# Altium schematic sheet AuxBoard.SchDoc
size A
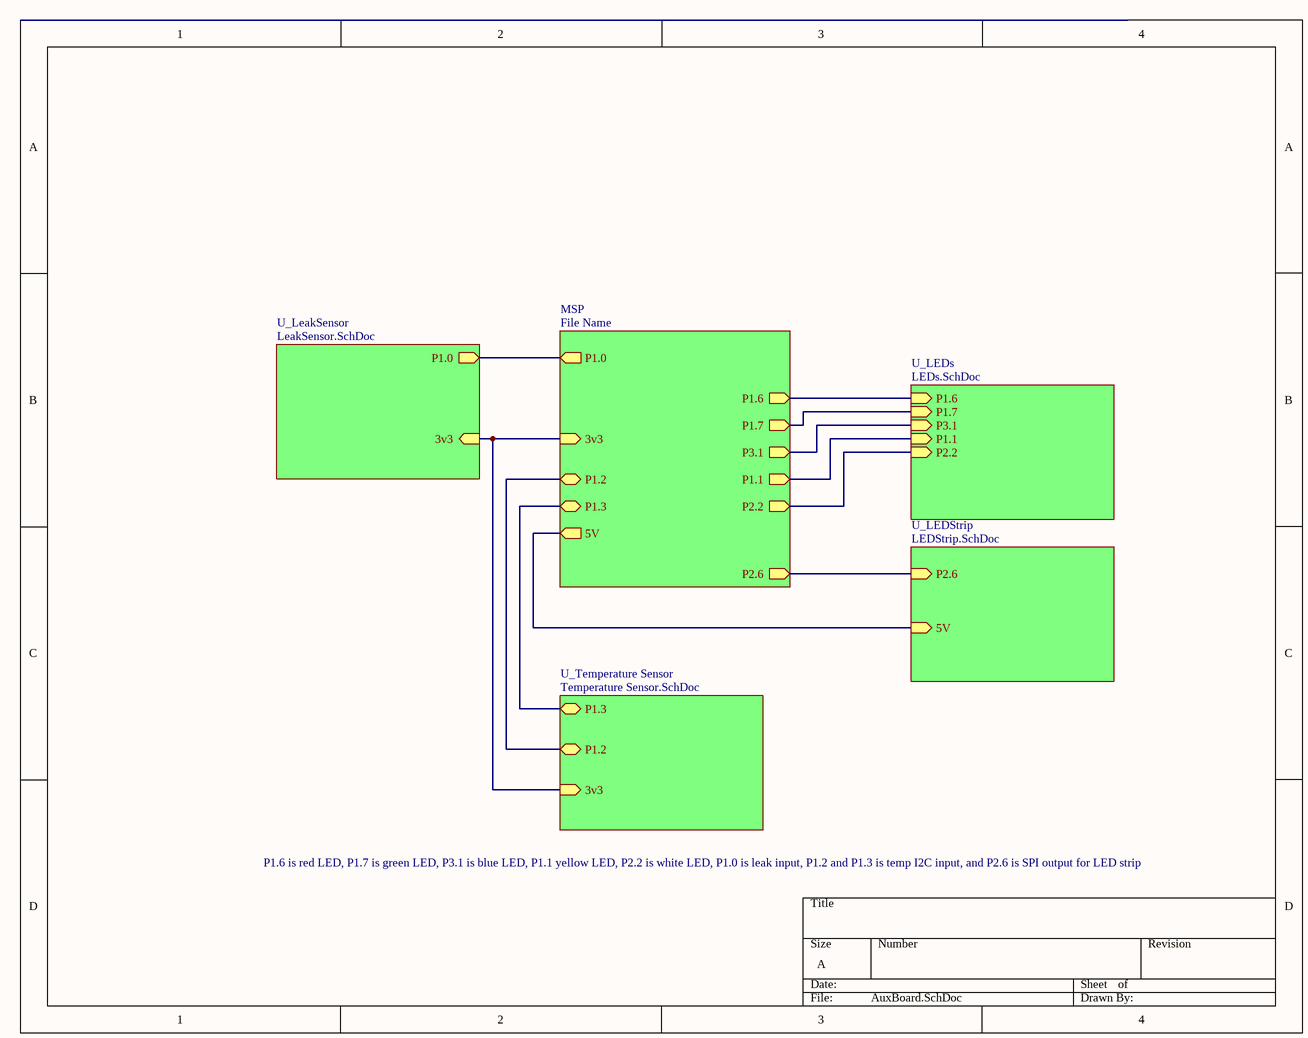
[diagram p0: AuxBoard.SchDoc]

## Sub-sheets
MSP = File Name: P1.0 (out), 3v3 (in), P1.2 (bidir), P1.3 (bidir), 5V (out), P2.6 (out), P1.6 (out), P1.7 (out), P3.1 (out), P1.1 (out), P2.2 (out)
U_LeakSensor = LeakSensor.SchDoc: 3v3 (in), P1.0 (out)
U_LEDs = LEDs.SchDoc: P1.6 (in), P1.7 (in), P3.1 (in), P1.1 (in), P2.2 (in)
U_LEDStrip = LEDStrip.SchDoc: 5V (in), P2.6 (in)
U_Temperature Sensor = Temperature Sensor.SchDoc: P1.2 (bidir), P1.3 (bidir), 3v3 (in)

## Nets
(unnamed): sheet MSP/P1.0, sheet U_LeakSensor/P1.0
(unnamed): sheet MSP/3v3, sheet U_LeakSensor/3v3, sheet U_Temperature Sensor/3v3
(unnamed): sheet MSP/P1.2, sheet U_Temperature Sensor/P1.2
(unnamed): sheet MSP/P1.3, sheet U_Temperature Sensor/P1.3
(unnamed): sheet MSP/5V, sheet U_LEDStrip/5V
(unnamed): sheet MSP/P2.6, sheet U_LEDStrip/P2.6
(unnamed): sheet MSP/P1.6, sheet U_LEDs/P1.6
(unnamed): sheet MSP/P1.7, sheet U_LEDs/P1.7
(unnamed): sheet MSP/P3.1, sheet U_LEDs/P3.1
(unnamed): sheet MSP/P1.1, sheet U_LEDs/P1.1
(unnamed): sheet MSP/P2.2, sheet U_LEDs/P2.2

## Notes on the sheet
- P1.6 is red LED, P1.7 is green LED, P3.1 is blue LED, P1.1 yellow LED, P2.2 is white LED, P1.0 is leak input, P1.2 and P1.3 is temp I2C input, and P2.6 is SPI output for LED strip